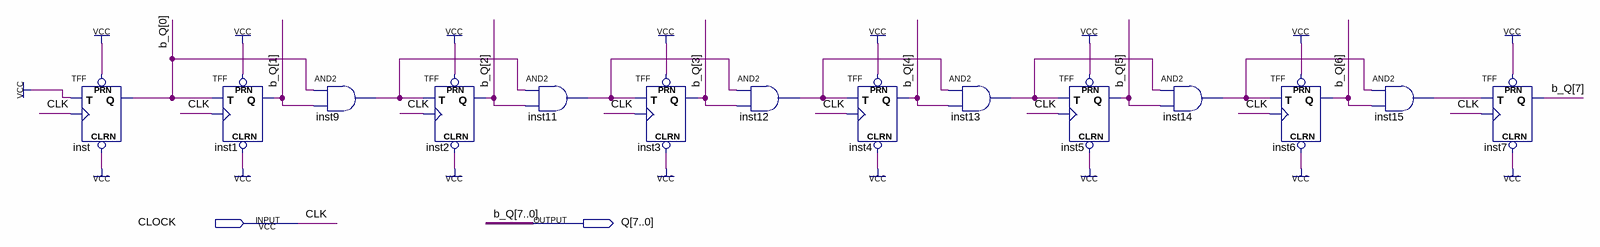
[diagram p0: schematic sheet]
// Quartus schematic Contador.bdf as structural Verilog: 14 symbols, 2 pins
module Contador (
  input  CLOCK,
  output [7:0] Q
);

  wire inst9_out, inst11_out, inst12_out, inst13_out, inst14_out, inst15_out;

  TFF inst (.PRN(1'b1), .CLRN(1'b1), .T(1'b1), .CLK(CLOCK), .Q(Q[0]));
  TFF inst1 (.PRN(1'b1), .CLRN(1'b1), .T(Q[0]), .CLK(CLOCK), .Q(Q[1]));
  and inst9 (inst9_out, Q[0], Q[1]);
  TFF inst2 (.PRN(1'b1), .CLRN(1'b1), .T(inst9_out), .CLK(CLOCK), .Q(Q[2]));
  and inst11 (inst11_out, inst9_out, Q[2]);
  TFF inst3 (.PRN(1'b1), .CLRN(1'b1), .T(inst11_out), .CLK(CLOCK), .Q(Q[3]));
  and inst12 (inst12_out, inst11_out, Q[3]);
  TFF inst4 (.PRN(1'b1), .CLRN(1'b1), .T(inst12_out), .CLK(CLOCK), .Q(Q[4]));
  and inst13 (inst13_out, inst12_out, Q[4]);
  TFF inst5 (.PRN(1'b1), .CLRN(1'b1), .T(inst13_out), .CLK(CLOCK), .Q(Q[5]));
  and inst14 (inst14_out, inst13_out, Q[5]);
  TFF inst6 (.PRN(1'b1), .CLRN(1'b1), .T(inst14_out), .CLK(CLOCK), .Q(Q[6]));
  and inst15 (inst15_out, inst14_out, Q[6]);
  TFF inst7 (.PRN(1'b1), .CLRN(1'b1), .T(inst15_out), .CLK(CLOCK), .Q(Q[7]));

  // Other names for the same wires on the sheet: b_Q[7:0] = Q; CLK = CLOCK
endmodule
